# EAGLE board uSlices_v3.2 (EAGLE 8.3.2)
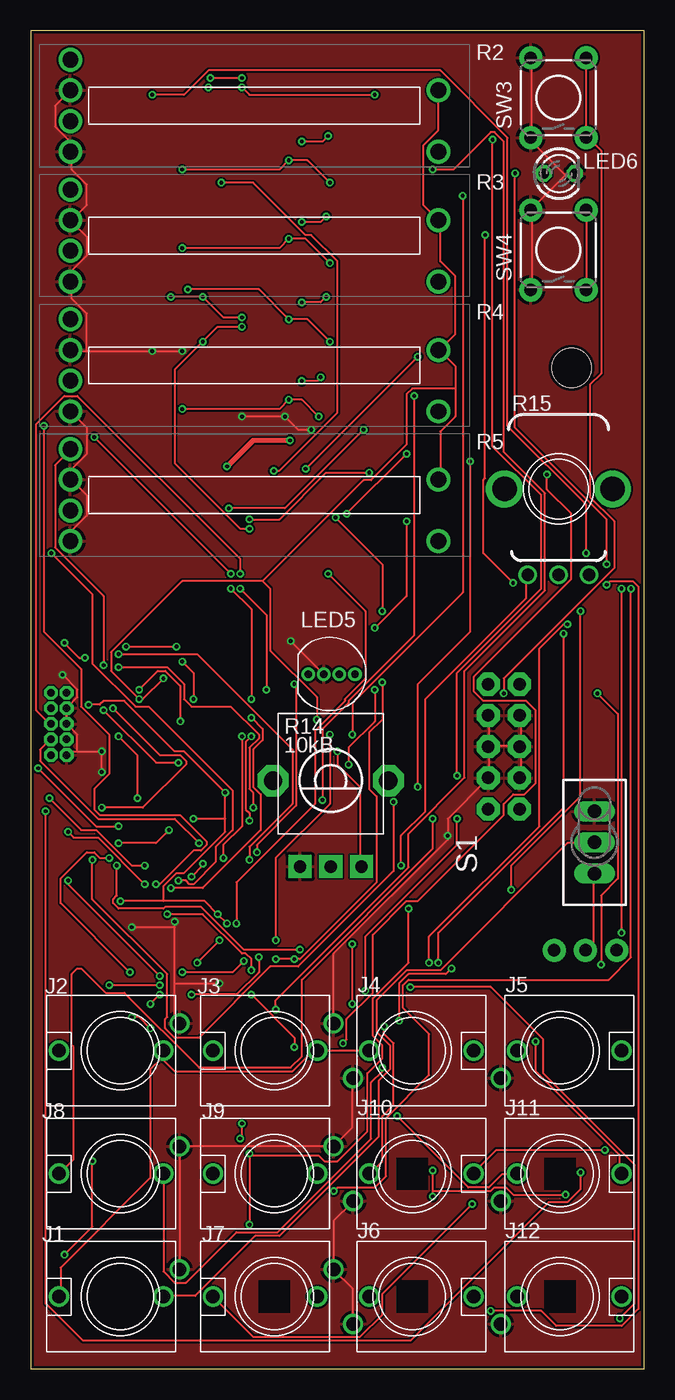
[diagram p3: board, top side]
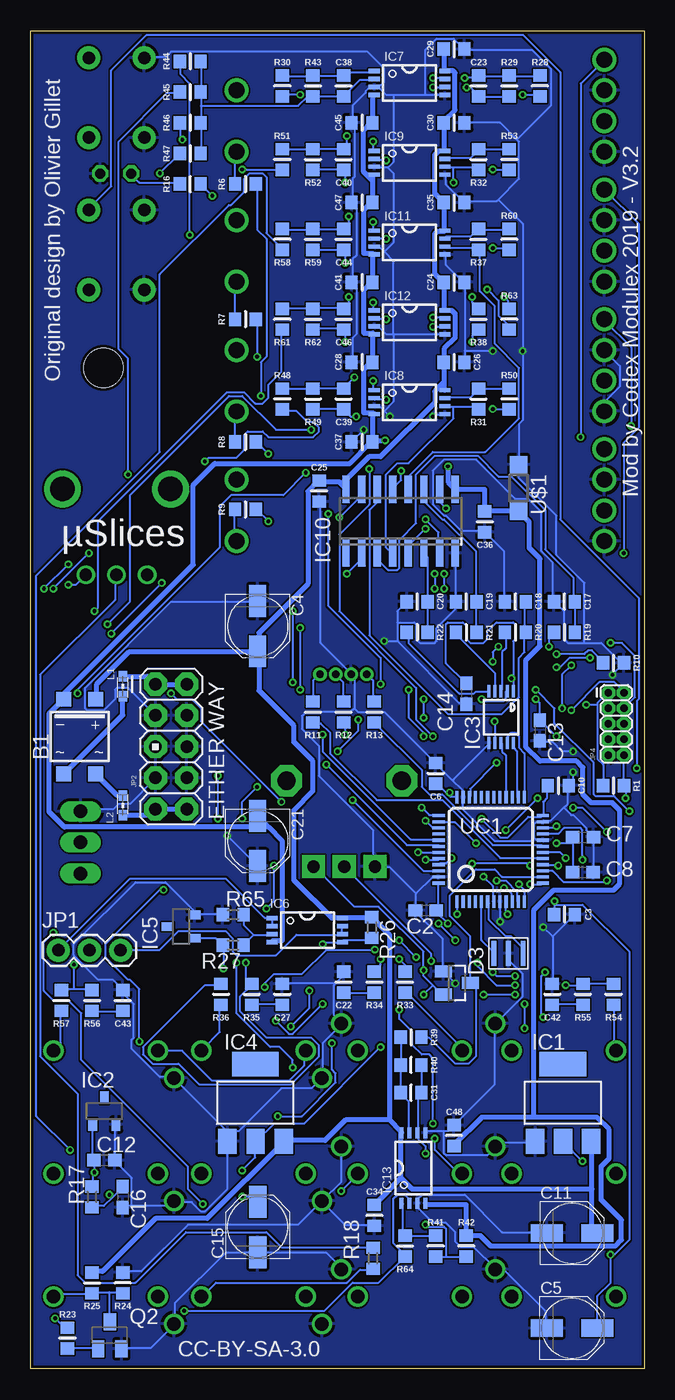
[diagram p4: board, bottom side, seen from below]

Size 50 x 109 mm. Coordinates in mm from the lower left corner, seen from the top.
Outline: 0,0 50,0 50,109 0,109 0,0
Copper layers (1*16): Top 0.035mm / dielectric 1.5mm / Bottom 0.035mm
Design rules "dirt_cheap_dirty_boards.v1.1": minimum track width 6mil, minimum drill 12mil, track to track 6mil, track to pad 6mil, pad to pad 6mil, via to via 6mil, smd to smd 0mil, copper to edge 10mil, drill to drill 10mil, minimum pad ring 10mil, minimum via ring 6mil, stop-mask expansion 2mil, vias tented up to drill 25mil, thermal gap 10mil
Holes 3.2 mm at 44.07,81.53

## Footprints (pad centres in the part's own frame; a part is rotated, then mirrored left to right if it is on the bottom)
SOIC-4 = smd 1.2 x 1.2: + 1.3,3.05; - -1.3,3.05; ~1 -1.3,-3.05; ~2 1.3,-3.05
C0603 = smd 1.1 x 1: 1 -0.85,0; 2 0.85,0
PARTS_AMAN_RESISTOR_0603 = smd 1 x 1.1: 1 -0.85,0; 2 0.85,0
PANASONIC_C = smd 2.6 x 1.4: + 2.05,0; - -2.05,0
SOT23 = smd 1 x 1.4: 1 -0.95,-1.1; 2 0.95,-1.1; 3 0,1.1
SOT223 = smd 1.499 x 2.007: 1 -2.261,-3.15; 2 0.025,-3.15; 3 2.311,-3.15 | smd 3.81 x 2.007: 4 0,3.15
DBZ_R-PDSO-G3 = smd 0.7 x 1: 1 -0.95,-1.1; 2 0.95,-1.1; 3 0,1.1
MSOP10 = smd 0.25 x 1: 1 -1,-2.113; 2 -0.5,-2.113; 3 0,-2.113; 4 0.5,-2.113; 5 1,-2.113; 6 1,2.113; 7 0.5,2.113; 8 0,2.113; 9 -0.5,2.113; 10 -1,2.113
TSSOP-8 = smd 0.9 x 0.35: 1 -2.875,0.975; 2 -2.875,0.325; 3 -2.875,-0.325; 4 -2.875,-0.975; 5 2.875,-0.975; 6 2.875,-0.325; 7 2.875,0.325; 8 2.875,0.975
SOIC16N = smd 0.6 x 2.2: 1 -4.445,-2.6; 2 -3.175,-2.6; 3 -1.905,-2.6; 4 -0.635,-2.6; 5 0.635,-2.6; 6 1.905,-2.6; 7 3.175,-2.6; 8 4.445,-2.6; 9 4.445,2.6; 10 3.175,2.6; 11 1.905,2.6; 12 0.635,2.6; 13 -0.635,2.6; 14 -1.905,2.6; 15 -3.175,2.6; 16 -4.445,2.6
INSTRUO_S_JACK_S2_INV = drill 1.1: GND 2.223,-4.826; NORM 0,-3.5; TIP 0,5
1X03 = drill 1.016 pad 1.88: 1 0,0; 2 2.54,0; 3 5.08,0
AVR_ICSP = drill 1.016 pad 1.88 octagon: 1 -1.27,5.08; 2 1.27,5.08; 3 -1.27,2.54; 4 1.27,2.54; 5 -1.27,0; 6 1.27,0; 7 -1.27,-2.54; 8 1.27,-2.54; 9 -1.27,-5.08; 10 1.27,-5.08
2X5-1.27 = drill 0.61 pad 1.067 octagon: 1 -1.27,3.81; 2 0,3.81; 3 -1.27,2.54; 4 0,2.54; 5 -1.27,1.27; 6 0,1.27; 7 -1.27,0; 8 0,0; 9 -1.27,-1.27; 10 0,-1.27
WUERTH-ELEKTRONIK_0603 = smd 0.85 x 0.7: 1 -0.9,0; 2 0.7,0
LED-TRICOLOR-THROUGHHOLE = drill 0.6: BLU 0.635,0; GND -0.635,0; GRN 1.905,0; RED -1.905,0
LED3MM = drill 0.813 octagon: A -1.27,0; K 1.27,0
INSTRUO_CRYSTAL_SMALLER = smd 0.4 x 2: GND 0,0; X1 -1.2,0; X2 1.2,0
SOT23-BEC = smd 1 x 1.4: B -0.95,-1.1; C 0,1.1; E 0.95,-1.1
PTL2010G0103B2 = drill 1.3 pad 1.95: 1 2.5,3.75; 2 2.5,1.25; 3 2.5,-1.25; 4 2.5,-3.75; 5 32.5,-3.75; 6 32.5,1.25
ALPS_POT_VERTICAL_PS = drill 1 pad 1.88 square: P$1 -2.5,7; P$2 0,7; P$3 2.5,7 | drill 1.5 pad 2.54 octagon: P$4 -4.7,0; P$5 4.7,0
INSTRUO_Q-POT2 = drill 1 pad 1.5: P$1 -2.5,-7; P$2 0,-7; P$3 2.5,-7 | drill 2 pad 2.5: P$4 -4.4,0; P$5 4.4,0
R0603 = smd 1 x 1.1: 1 -0.85,0; 2 0.85,0
TL3XPO = drill 1.1 pad 1.422 long: 1 -2.54,0; 2 0,0; 3 2.54,0
SPARKFUN_TACTILE-PTH = drill 1.016 pad 1.88: 1 -3.251,2.261; 2 3.251,2.261; 3 -3.251,-2.261; 4 3.251,-2.261
SOD123 = smd 1.4 x 1.4: A 1.9,0; C -1.9,0
LQFP48 = smd 0.254 x 1: 1 -2.75,-4.25; 2 -2.25,-4.25; 3 -1.75,-4.25; 4 -1.25,-4.25; 5 -0.75,-4.25; 6 -0.25,-4.25; 7 0.25,-4.25; 8 0.75,-4.25; 9 1.25,-4.25; 10 1.75,-4.25; 11 2.25,-4.25; 12 2.75,-4.25; 25 2.75,4.25; 26 2.25,4.25; 27 1.75,4.25; 28 1.25,4.25; 29 0.75,4.25; 30 0.25,4.25; 31 -0.25,4.25; 32 -0.75,4.25; 33 -1.25,4.25; 34 -1.75,4.25; 35 -2.25,4.25; 36 -2.75,4.25 | smd 1 x 0.254: 13 4.25,-2.75; 14 4.25,-2.25; 15 4.25,-1.75; 16 4.25,-1.25; 17 4.25,-0.75; 18 4.25,-0.25; 19 4.25,0.25; 20 4.25,0.75; 21 4.25,1.25; 22 4.25,1.75; 23 4.25,2.25; 24 4.25,2.75; 37 -4.25,2.75; 38 -4.25,2.25; 39 -4.25,1.75; 40 -4.25,1.25; 41 -4.25,0.75; 42 -4.25,0.25; 43 -4.25,-0.25; 44 -4.25,-0.75; 45 -4.25,-1.25; 46 -4.25,-1.75; 47 -4.25,-2.25; 48 -4.25,-2.75

## Placement (x,y rotation side)
B1  MB1S  [SOIC-4]  46,51.5 0 bottom
C2  100n  [C0603]  17.8,37.34 180 bottom
C3  100n  [PARTS_AMAN_RESISTOR_0603]  6.5,37 0 bottom
C4  22u  [PANASONIC_C]  31.5,60.5 270 bottom
C5  22u  [PANASONIC_C]  5.89,3.32 0 bottom
C6  100n  [PARTS_AMAN_RESISTOR_0603]  17,48.5 90 bottom
C7  100n  [C0603]  5,43.31 0 bottom
C8  3.3u  [C0603]  5.01,40.45 0 bottom
C10  100n  [PARTS_AMAN_RESISTOR_0603]  7,47.5 0 bottom
C11  22u  [PANASONIC_C]  5.88,11.06 0 bottom
C12  470n  [C0603]  44,17 0 bottom
C13  100n  [C0603]  8.5,52 270 bottom
C14  3.3u  [C0603]  14.5,55 270 bottom
C15  22u  [PANASONIC_C]  31.5,11.56 90 bottom
C16  100n  [C0603]  42.5,14 270 bottom
C17  1u  [PARTS_AMAN_RESISTOR_0603]  6.5,62.5 180 bottom
C18  1u  [PARTS_AMAN_RESISTOR_0603]  10.5,62.5 180 bottom
C19  1u  [PARTS_AMAN_RESISTOR_0603]  14.5,62.5 180 bottom
C20  1u  [PARTS_AMAN_RESISTOR_0603]  18.5,62.5 180 bottom
C21  22u  [PANASONIC_C]  31.5,43 270 bottom
C22  560p  [PARTS_AMAN_RESISTOR_0603]  24.5,31.5 90 bottom
C23  18p  [PARTS_AMAN_RESISTOR_0603]  13.5,104.5 90 bottom
C24  100n  [PARTS_AMAN_RESISTOR_0603]  15.5,88.5 0 bottom
C25  100n  [PARTS_AMAN_RESISTOR_0603]  26.5,71.5 270 bottom
C26  100n  [PARTS_AMAN_RESISTOR_0603]  15.5,82 0 bottom
C27  560p  [PARTS_AMAN_RESISTOR_0603]  29.5,30.5 90 bottom
C28  100n  [PARTS_AMAN_RESISTOR_0603]  23,82 0 bottom
C29  100n  [PARTS_AMAN_RESISTOR_0603]  15.5,107.5 0 bottom
C30  100n  [PARTS_AMAN_RESISTOR_0603]  15.5,101.5 0 bottom
C31  560p  [PARTS_AMAN_RESISTOR_0603]  19,22.5 180 bottom
C34  100n  [PARTS_AMAN_RESISTOR_0603]  22,12.5 270 bottom
C35  100n  [PARTS_AMAN_RESISTOR_0603]  15.5,95 0 bottom
C36  100n  [PARTS_AMAN_RESISTOR_0603]  13,69 90 bottom
C37  100n  [PARTS_AMAN_RESISTOR_0603]  23,75.5 0 bottom
C38  18p  [PARTS_AMAN_RESISTOR_0603]  24.5,104.5 90 bottom
C39  18p  [PARTS_AMAN_RESISTOR_0603]  24.5,79 90 bottom
C40  18p  [PARTS_AMAN_RESISTOR_0603]  24.5,98.5 90 bottom
C41  100n  [PARTS_AMAN_RESISTOR_0603]  23,88.5 0 bottom
C42  560p  [PARTS_AMAN_RESISTOR_0603]  7.5,30.5 90 bottom
C43  560p  [PARTS_AMAN_RESISTOR_0603]  42.5,30 90 bottom
C44  18p  [PARTS_AMAN_RESISTOR_0603]  24.5,92 90 bottom
C45  100n  [PARTS_AMAN_RESISTOR_0603]  23,101.5 0 bottom
C46  18p  [PARTS_AMAN_RESISTOR_0603]  24.5,85.5 90 bottom
C47  100n  [PARTS_AMAN_RESISTOR_0603]  23,95 0 bottom
C48  100n  [PARTS_AMAN_RESISTOR_0603]  15.5,19 270 bottom
D3  BAT54S  [SOT23]  15.26,31.43 270 bottom
IC1  LM1117-3.3  [SOT223]  6.63,21.68 0 bottom
IC2  LM4040B25  [DBZ_R-PDSO-G3]  44,21 0 bottom
IC3  DAC124S085CIMT  [MSOP10]  11.67,53.09 180 bottom
IC4  LM1117-3.3  [SOT223]  31.7,21.68 0 bottom
IC5  LM4040B10  [DBZ_R-PDSO-G3]  37.74,36.02 90 bottom
IC6  TL072TSSOP  [TSSOP-8]  27.45,35.74 0 bottom
IC7  TL072TSSOP  [TSSOP-8]  19.13,104.74 0 bottom
IC8  TL072TSSOP  [TSSOP-8]  19.13,78.74 0 bottom
IC9  TL072TSSOP  [TSSOP-8]  19.13,98.24 0 bottom
IC10  V2164SZ  [SOIC16N]  19.86,69.04 0 bottom
IC11  TL072TSSOP  [TSSOP-8]  19.13,91.74 0 bottom
IC12  TL072TSSOP  [TSSOP-8]  19.13,85.24 0 bottom
IC13  TL072TSSOP  [TSSOP-8]  18.81,16.36 90 bottom
J1  [INSTRUO_S_JACK_S2_INV]  7.31,5.88 90 top
J2  [INSTRUO_S_JACK_S2_INV]  7.31,25.91 90 top
J3  [INSTRUO_S_JACK_S2_INV]  19.86,25.91 90 top
J4  [INSTRUO_S_JACK_S2_INV]  31.09,25.91 270 top
J5  [INSTRUO_S_JACK_S2_INV]  43.14,25.91 270 top
J6  [INSTRUO_S_JACK_S2_INV]  31.09,5.88 270 top
J7  [INSTRUO_S_JACK_S2_INV]  19.86,5.88 90 top
J8  [INSTRUO_S_JACK_S2_INV]  7.31,15.89 90 top
J9  [INSTRUO_S_JACK_S2_INV]  19.86,15.89 90 top
J10  [INSTRUO_S_JACK_S2_INV]  31.09,15.89 270 top
J11  [INSTRUO_S_JACK_S2_INV]  43.14,15.89 270 top
J12  [INSTRUO_S_JACK_S2_INV]  43.14,5.88 270 top
JP1  [1X03]  47.75,34.09 0 bottom
JP2  M05X2PTH  [AVR_ICSP]  38.56,50.68 0 bottom
JP4  M05X2MINIJTAG  [2X5-1.27]  1.66,51.27 0 bottom
L1  [WUERTH-ELEKTRONIK_0603]  42.5,55.5 270 bottom
L2  [WUERTH-ELEKTRONIK_0603]  42.5,46 90 bottom
LED5  WP154A4SUREQBFZG  [LED-TRICOLOR-THROUGHHOLE]  24.52,56.58 0 top
LED6  [LED3MM]  43.07,97.37 0 top
Q1  8MHz  [INSTRUO_CRYSTAL_SMALLER]  11.07,33.84 0 bottom
Q2  MMBT3904  [SOT23-BEC]  43.55,2.74 0 bottom
R1  10k  [PARTS_AMAN_RESISTOR_0603]  2.5,47.5 180 bottom
R2  PTL20-10G0-103B2  [PTL2010G0103B2]  0.74,102.89 0 top
R3  PTL20-10G0-103B2  [PTL2010G0103B2]  0.74,92.32 0 top
R4  PTL20-10G0-103B2  [PTL2010G0103B2]  0.74,81.74 0 top
R5  PTL20-10G0-103B2  [PTL2010G0103B2]  0.74,71.17 0 top
R6  100  [PARTS_AMAN_RESISTOR_0603]  32.5,96.5 0 bottom
R7  100  [PARTS_AMAN_RESISTOR_0603]  32.5,85.5 0 bottom
R8  100  [PARTS_AMAN_RESISTOR_0603]  32.5,75.5 0 bottom
R9  100  [PARTS_AMAN_RESISTOR_0603]  32.5,70 0 bottom
R10  10k  [PARTS_AMAN_RESISTOR_0603]  2.5,57.5 180 bottom
R11  100  [PARTS_AMAN_RESISTOR_0603]  27,53.5 90 bottom
R12  100  [PARTS_AMAN_RESISTOR_0603]  24.5,53.5 90 bottom
R13  100  [PARTS_AMAN_RESISTOR_0603]  22,53.5 90 bottom
R14  10kB  [ALPS_POT_VERTICAL_PS]  24.45,47.91 180 top
R15  10kB CD  [INSTRUO_Q-POT2]  43.01,71.67 0 top
R16  100  [PARTS_AMAN_RESISTOR_0603]  37,96.5 180 bottom
R17  510  [R0603]  45,14 90 bottom
R18  100k  [R0603]  22.1,9 90 bottom
R19  100  [PARTS_AMAN_RESISTOR_0603]  6.5,60 0 bottom
R20  100  [PARTS_AMAN_RESISTOR_0603]  10.5,60 0 bottom
R21  100  [PARTS_AMAN_RESISTOR_0603]  14.5,60 0 bottom
R22  100  [PARTS_AMAN_RESISTOR_0603]  18.5,60 0 bottom
R23  10k  [PARTS_AMAN_RESISTOR_0603]  47,2.5 270 bottom
R24  3.3k  [PARTS_AMAN_RESISTOR_0603]  42.5,7 270 bottom
R25  4.7k  [PARTS_AMAN_RESISTOR_0603]  45,7 90 bottom
R26  4.7k  [R0603]  22.19,35.95 270 bottom
R27  100k  [R0603]  33.5,34.5 180 bottom
R28  1k  [PARTS_AMAN_RESISTOR_0603]  8.5,104.5 270 bottom
R29  100k  [PARTS_AMAN_RESISTOR_0603]  11,104.5 90 bottom
R30  100k  [PARTS_AMAN_RESISTOR_0603]  29.5,104.5 270 bottom
R31  100k  [PARTS_AMAN_RESISTOR_0603]  13.5,79 90 bottom
R32  100k  [PARTS_AMAN_RESISTOR_0603]  13.5,98.5 90 bottom
R33  100k  [PARTS_AMAN_RESISTOR_0603]  19.5,31.5 90 bottom
R34  510  [PARTS_AMAN_RESISTOR_0603]  22,31.5 90 bottom
R35  510  [PARTS_AMAN_RESISTOR_0603]  32,30.5 90 bottom
R36  100k  [PARTS_AMAN_RESISTOR_0603]  34.5,30.5 90 bottom
R37  100k  [PARTS_AMAN_RESISTOR_0603]  13.5,92 90 bottom
R38  100k  [PARTS_AMAN_RESISTOR_0603]  13.5,85.5 90 bottom
R39  1k  [PARTS_AMAN_RESISTOR_0603]  19,27 0 bottom
R40  33k  [PARTS_AMAN_RESISTOR_0603]  19,24.75 180 bottom
R41  100k  [PARTS_AMAN_RESISTOR_0603]  17,10 270 bottom
R42  240k  [PARTS_AMAN_RESISTOR_0603]  14.5,10 270 bottom
R43  49.9k  [PARTS_AMAN_RESISTOR_0603]  27,104.5 90 bottom
R44  100k  [PARTS_AMAN_RESISTOR_0603]  37,106.5 0 bottom
R45  100k  [PARTS_AMAN_RESISTOR_0603]  37,104 0 bottom
R46  100k  [PARTS_AMAN_RESISTOR_0603]  37,101.5 0 bottom
R47  100k  [PARTS_AMAN_RESISTOR_0603]  37,99 0 bottom
R48  1k  [PARTS_AMAN_RESISTOR_0603]  29.5,79 270 bottom
R49  100k  [PARTS_AMAN_RESISTOR_0603]  27,79 90 bottom
R50  100k  [PARTS_AMAN_RESISTOR_0603]  11,79 270 bottom
R51  1k  [PARTS_AMAN_RESISTOR_0603]  29.5,98.5 270 bottom
R52  100k  [PARTS_AMAN_RESISTOR_0603]  27,98.5 90 bottom
R53  100k  [PARTS_AMAN_RESISTOR_0603]  11,98.5 270 bottom
R54  100k  [PARTS_AMAN_RESISTOR_0603]  2.5,30.5 90 bottom
R55  510  [PARTS_AMAN_RESISTOR_0603]  5,30.5 90 bottom
R56  510  [PARTS_AMAN_RESISTOR_0603]  45,30 90 bottom
R57  100k  [PARTS_AMAN_RESISTOR_0603]  47.5,30 90 bottom
R58  1k  [PARTS_AMAN_RESISTOR_0603]  29.5,92 270 bottom
R59  100k  [PARTS_AMAN_RESISTOR_0603]  27,92 90 bottom
R60  100k  [PARTS_AMAN_RESISTOR_0603]  11,92 270 bottom
R61  1k  [PARTS_AMAN_RESISTOR_0603]  29.5,85.5 270 bottom
R62  100k  [PARTS_AMAN_RESISTOR_0603]  27,85.5 90 bottom
R63  100k  [PARTS_AMAN_RESISTOR_0603]  11,85.5 270 bottom
R64  100k  [PARTS_AMAN_RESISTOR_0603]  19.5,10 90 bottom
R65  100k  [R0603]  33.5,37 0 bottom
S1  TL32PO  [TL3XPO]  45.94,42.88 270 top
SW3  [SPARKFUN_TACTILE-PTH]  43.01,103.54 90 top
SW4  [SPARKFUN_TACTILE-PTH]  43.01,91.14 90 top
U$1  1N5819HW  [SOD123]  10.25,71.75 270 bottom
UC1  STM32F103CBT6  [LQFP48]  12.51,42.31 0 bottom

## Tracks (layer width: path | path; a pad name or v marks a point on that pad's centre or on a via)
+3V3  (via drill 0.3)
  Top 0.152: v5.03,16.92 5.03,11.58 v2.74,9.3 | v16,36.27 v15.24,37.03 14.17,38.1 10.82,38.1 | 10.82,38.1 v7.32,38.1 | 15.85,44.81 15.85,43.74 12.5,40.39 11.89,40.39 10.82,39.32 10.82,38.1 | 15.85,44.81 v15.85,46.94 12.5,50.29 11.73,50.29 7.62,54.41 5.94,54.41 5.64,54.1 v4.72,54.1 | 15.85,44.81 v13.26,44.81
  Bottom 0.152: v5.03,16.92 6.55,18.44 IC1.2 | C5.+ 3.81,3.35 3.81,5.94 2.74,7.01 v2.74,9.3 2.44,9.3 1.22,10.52 1.22,33.98 5.03,37.8 7.32,37.8 | 3.81,54.1 3.81,54.25 3.05,55.02 JP4.1 | 3.81,54.1 3.81,49.68 3.35,49.23 3.35,47.55 R1.2 | C10.1 7.92,47.4 7.92,46.48 8.23,46.18 8.23,45.11 UC1.24 8.38,44.96 9.45,44.96 11.12,43.28 11.73,43.28 v13.26,44.81 | 16,46.79 16.92,47.7 C6.1 | 16,46.79 15.85,46.63 15.24,46.63 UC1.36 | v15.24,37.03 15.24,37.95 UC1.1 | v16,36.27 16.92,37.19 C2.1 16.92,37.34 16.76,37.49 16.76,39.47 UC1.48 | v7.32,38.1 7.32,37.8 | 7.32,37.8 7.32,37.03 C3.1 | v15.85,46.94 16,46.79 | v4.72,54.1 3.81,54.1
+3V3_A  (via drill 0.3)
  Top 0.152: v32.77,14.02 32.77,14.48 | 32.77,14.48 v32.77,16.15 | v43.59,14.17 39.32,14.17 38.71,14.78 37.8,14.78 37.49,14.48 32.77,14.48 | v11.12,37.03 14.02,37.03 17.22,33.83 17.53,33.83 17.98,33.38 v17.98,32.46 | v21.49,26.21 21.49,26.98 v17.98,30.48 | v10.82,56.24 9.14,54.56 v8.84,54.56 6.55,56.84 6.55,58.37 12.34,64.16 18.9,64.16 | v7.16,42.82 10.21,42.82 v11.28,43.89 | v8.69,46.48 8.69,49.99 v7.16,51.51 | 34.59,79.86 34.59,81.69 33.38,82.91 R4.6 33.38,83.06 34.59,84.28 34.59,89 33.38,90.22 33.38,93.42 R3.6 33.22,93.57 32,94.79 32,99.67 33.22,100.89 33.22,104.09 R2.6 | 34.59,79.86 34.59,77.57 33.38,76.35 33.38,72.54 R5.6 | 18.9,64.16 27.13,72.39 27.74,72.39 30.63,75.29 30.63,79.4 31.09,79.86 34.59,79.86 | v24.99,50.29 24.99,49.23 26.82,47.4 26.82,41 R14.P$1 | v23.32,52.88 23.32,54.71 19.51,58.52 19.51,63.55 18.9,64.16
  Bottom 0.152: 43.28,14.02 42.52,14.78 C16.1 | 43.28,14.02 44.04,13.26 44.96,13.26 R17.1 | v32.77,16.15 31.7,17.22 31.7,18.44 IC4.2 31.55,18.59 30.18,19.96 27.74,19.96 v21.49,26.21 | v32.77,14.02 31.85,14.02 31.55,13.72 C15.+ | 43.28,14.02 43.43,14.02 v43.59,14.17 | v11.12,37.03 11.28,37.19 11.28,37.95 UC1.9 | 17.22,31.24 16.46,30.48 D3.2 | 17.22,31.24 17.98,32 v17.98,32.46 17.98,33.98 21.64,37.64 23.62,37.64 26.82,40.84 R14.P$1 | 17.22,31.24 v17.98,30.48 | 5.79,42.82 5.79,40.54 C8.1 | 5.79,42.82 5.79,43.28 C7.1 5.79,42.82 | 10.67,56.24 10.67,59.28 10.52,59.44 10.52,60.66 10.67,60.81 12.04,60.81 12.8,60.05 12.8,59.44 13.11,59.13 14.17,59.13 14.48,59.44 14.48,60.5 14.78,60.81 16,60.81 16.15,60.66 16.15,57.45 14.63,55.93 C14.1 | 10.67,56.24 10.67,55.32 IC3.1 | v8.84,54.56 8.53,54.25 8.53,52.88 C13.1 8.38,52.73 v7.16,51.51 | 10.67,56.24 v10.82,56.24 | v7.16,42.82 5.79,42.82 | v8.69,46.48 v11.28,43.89 | v24.99,50.29 23.32,51.97 v23.32,52.88
ADD_SWITCH  (via drill 0.3)
  Top 0.152: v5.03,41.45 5.03,38.25 11.12,32.16 11.12,28.65 10.97,28.5 10.97,27.74 11.73,26.98 13.72,26.98 19.51,32.77 21.79,32.77 29.57,40.54 v29.57,46.18 | v38.56,55.02 38.56,56.24 47.55,65.23 47.55,69.04 45.57,71.02 45.57,80.16 46.48,81.08 46.48,99.21 45.41,100.28 SW3.3 45.26,100.43 45.26,106.68 SW3.4
  Bottom 0.152: v5.03,41.45 5.03,43.89 5.18,44.04 6.55,44.04 7.01,43.59 8.23,43.59 UC1.21 | v29.57,46.18 36.12,52.73 36.12,53.8 36.88,54.56 38.1,54.56 v38.56,55.02
AREF_2.5  (via drill 0.3)
  Top 0.152: v12.19,52.73 12.19,55.63 10.97,56.84 10.36,56.84 v8.84,55.32 | v1.22,45.41 1.22,5.33 4.27,2.29 30.94,2.29 42.22,13.56 43.74,13.56 44.81,14.63 v44.81,16
  Bottom 0.152: v12.19,52.73 12.19,51.05 IC3.7 | v8.84,55.32 7.32,53.8 7.32,52.58 4.12,49.38 4.12,46.79 3.96,46.63 2.44,46.63 v1.22,45.41 | IC2.1 44.96,19.81 44.96,17.07 C12.1 44.81,16.92 v44.81,16 44.96,15.85 44.96,14.94 R17.2
AREF_5
  Bottom 0.152: IC6.2 30.33,36.12 30.33,36.58 IC6.1 30.94,36.73 34.14,39.93 41.91,39.93 47.7,34.14 JP1.1
AREF_10
  Bottom 0.152: IC6.7 24.69,35.97 24.69,35.51 IC6.6 24.69,35.36 28.35,35.36 30.02,33.68 33.22,33.68 33.53,33.98 33.53,35.05 34.14,35.66 37.95,35.66 39.47,34.14 42.52,34.14 JP1.3
AREF_10_0  (via drill 0.3)
  Top 0.152: v26.21,29.72 v26.21,34.59 | v30.02,28.35 30.02,31.39 30.79,32.16 33.83,32.16 v34.29,32.61
  Bottom 0.152: R26.2 22.25,35.05 22.4,34.9 24.54,34.9 IC6.5 24.69,34.75 26.06,34.75 v26.21,34.59 | IC5.1 36.58,35.05 34.9,35.05 34.44,34.59 R27.2 34.29,34.44 v34.29,32.61 | v26.21,29.72 28.65,27.28 28.96,27.28 v30.02,28.35
BOOT_FLASH  (via drill 0.3)
  Top 0.152: v17.83,41.45 17.83,42.52 21.34,46.02 21.34,50.44 13.56,58.22 v7.16,58.22
  Bottom 0.152: v17.83,41.45 16.76,41.45 UC1.44 | v7.16,58.22 4.88,58.22 4.57,58.52 4.27,58.52 3.35,57.61 R10.2
DAC_MOSI
  Bottom 0.152: UC1.28 11.28,46.63 11.28,49.99 11.58,50.29 11.58,50.9 IC3.8
DAC_SCK
  Bottom 0.152: UC1.26 10.36,46.63 10.36,50.29 10.67,50.6 10.67,50.9 IC3.10
DAC_SS
  Bottom 0.152: UC1.25 9.75,46.63 9.75,50.14 10.21,50.6 10.21,51.51 10.52,51.82 10.82,51.82 11.12,51.51 11.12,51.05 IC3.9
DEL_SWITCH  (via drill 0.3)
  Top 0.152: v7.16,44.2 5.33,44.2 v0.61,48.92 | SW4.3 45.26,87.94 45.26,94.34 SW4.4
  Bottom 0.152: v7.16,44.2 7.32,44.04 8.23,44.04 UC1.22 | v0.61,48.92 0.61,54.41 0.46,54.56 0.46,62.79 6.86,69.19 6.86,105.61 9.91,108.66 40.54,108.66 43.43,105.77 43.43,96.32 45.26,94.49 SW4.4
FB_CURRENT  (via drill 0.3)
  Top 0.152: v10.52,31.24 v6.4,31.24 | v15.39,34.9 v13.56,33.07 | v16.76,36.27 16.76,39.62 23.16,46.02 23.16,51.97 25.6,54.41 25.6,54.56 27.28,56.24 27.28,61.72 v24.23,64.77
  Bottom 0.152: R54.2 2.59,31.39 4.88,31.39 R55.2 5.03,31.24 v6.4,31.24 | v10.52,31.24 12.04,31.24 13.56,32.77 v13.56,33.07 | v16.76,36.27 v15.39,34.9 | v24.23,64.77 23.16,65.84 23.16,66.29 IC10.2
FB_CURRENT1  (via drill 0.3)
  Top 0.152: v19.96,33.38 v21.49,33.38 21.95,33.38 28.19,39.62 28.19,46.63 27.58,47.24 27.58,51.82 28.65,52.88 v28.65,55.93 | v28.65,61.72 28.65,65.53 v24.84,69.34
  Bottom 0.152: v19.96,33.38 19.51,32.92 19.51,32.46 R33.2 | v21.49,33.38 21.49,32.92 21.95,32.46 R34.2 | v28.65,61.72 v28.65,55.93 | v24.84,69.34 23.16,71.02 23.16,71.63 IC10.15
FB_CURRENT2  (via drill 0.3)
  Top 0.152: v16.15,70.1 20.73,70.1 v27.13,76.5 | v43.74,60.66 43.43,60.66 41.45,58.67 41.45,44.2 32.46,35.2 v32.46,33.07
  Bottom 0.152: R36.2 34.59,31.24 35.81,31.24 40.84,26.21 40.84,25.6 40.08,24.84 37.95,24.84 36.27,23.16 28.8,23.16 26.52,25.45 26.52,26.36 27.13,26.98 30.79,26.98 32.92,29.11 32.92,30.33 32,31.24 R35.2 32,31.39 32.46,31.85 v32.46,33.07 | v16.15,70.1 16.61,70.56 16.61,71.63 IC10.10 | v27.13,76.5 30.02,76.5 32.77,79.25 33.83,79.25 41.91,71.17 41.91,62.48 v43.74,60.66
FB_CURRENT3  (via drill 0.3)
  Top 0.152: v46.48,32.92 46.48,38.56 47.85,39.93 47.85,53.34 v46.18,55.02 | v27.58,73 24.08,73 20.27,69.19 v17.83,69.19
  Bottom 0.152: 46.48,30.94 47.4,30.94 R57.2 | 46.48,30.94 45.11,30.94 R56.2 | v46.48,32.92 46.48,30.94 | v46.18,55.02 46.18,55.32 34.59,66.9 34.59,70.26 33.68,71.17 29.41,71.17 v27.58,73 | v17.83,69.19 16.76,68.12 16.76,66.45 IC10.7
FRAME_CHANGE  (via drill 0.3)
  Top 0.152: v7.01,41 7.01,38.56 6.71,38.25 6.71,37.95 7.16,37.49 10.82,37.49 10.97,37.64 13.87,37.64 17.37,34.14 v21.95,34.14 | v30.94,31.09 37.49,31.09 41.76,26.82 41.76,24.08 49.23,16.61 49.23,5.33 v48.01,4.12
  Bottom 0.152: v7.01,41 8.23,41 UC1.16 | v21.95,34.14 25.91,34.14 27.89,32.16 30.18,32.16 30.94,31.39 v30.94,31.09 | v48.01,4.12 47.09,3.2 R23.1
GAIN_1
  Bottom 0.152: R19.2 5.64,60.05 5.64,62.48 C17.1 5.79,62.64 5.79,64.47 8.08,66.75 8.08,69.95 10.82,72.69 11.89,72.69 13.56,74.37 17.07,74.37 18.59,72.85 18.59,68.89 19.96,67.51 19.96,65.23 20.12,65.08 20.88,65.08 21.64,65.84 21.64,66.29 IC10.3
GAIN_2
  Bottom 0.152: C18.1 9.75,62.48 9.75,60.05 R20.2 9.75,59.89 9.75,58.37 10.21,57.91 10.21,54.71 11.58,53.34 16,53.34 22.4,59.74 22.4,69.95 21.79,70.56 21.79,71.63 IC10.14
GAIN_3
  Bottom 0.152: R21.2 13.72,60.05 13.72,62.48 C19.1 13.72,62.64 13.72,66.6 16.31,69.19 16.46,69.19 17.83,70.56 17.83,71.63 IC10.11
GAIN_4
  Bottom 0.152: R22.2 17.68,60.05 17.68,62.48 C20.1 17.68,62.64 17.68,66.14 17.83,66.29 IC10.6
GND  (via drill 0.3)
  Top 0.152: R2.2 3.2,104.09 1.98,102.87 1.98,101.19 3.2,99.97 3.2,99.21 R2.4 3.35,99.06 3.35,97.69 4.57,96.47 4.57,94.79 3.35,93.57 R3.2 3.35,93.42 4.57,92.2 4.57,90.68 3.35,89.46 3.35,88.7 R3.4 3.35,88.54 3.35,87.17 4.57,85.95 4.57,82.91 | R5.4 3.35,67.51 3.35,68.28 4.57,69.49 4.57,71.17 3.35,72.39 R5.2 3.35,72.54 3.35,73.3 4.57,74.52 4.57,76.66 3.35,77.88 R4.4 | 4.57,82.91 3.35,82.91 R4.2 | 4.57,82.91 v9.91,82.91 v12.34,82.91 | 43.59,97.23 44.2,97.23 LED6.K | 43.59,97.23 40.84,94.49 SW4.2 40.84,94.34 40.84,87.94 SW4.1 | 43.59,97.23 40.84,99.97 40.84,100.28 SW3.1 40.84,100.43 40.84,106.68 SW3.2 | v17.22,77.57 v20.73,77.57 21.79,76.5 v22.86,76.5 | 3.81,50.29 3.2,50.29 3.05,50.14 JP4.9 | 3.81,50.29 v5.79,50.29 v5.79,48.62 | 3.81,50.29 3.81,51.66 3.05,52.43 JP4.5 2.9,52.58 2.9,53.8 JP4.3 3.05,53.95 3.81,54.71 3.81,55.32 v2.59,56.54 | v21.18,59.28 23.77,56.69 LED5.GND | 11.73,31.39 11.73,28.5 12.04,28.19 J2.GND | 11.73,31.39 11.73,35.97 | 11.73,35.97 v11.73,36.42 | 11.73,35.97 v8.23,35.97 | J1.GND 12.19,8.23 12.19,17.98 J8.GND 12.19,18.14 24.54,18.14 J9.GND 24.69,18.14 26.21,19.66 26.21,23.62 J4.GND | 37.34,50.75 37.34,53.19 JP2.4 | JP2.5 39.93,50.75 39.93,53.19 JP2.3 | 37.34,50.75 39.78,50.75 JP2.5 | 37.34,50.75 JP2.6 37.34,50.6 37.34,48.16 JP2.8 37.19,48.01 33.98,44.81 v33.98,43.43 33.98,43.13 24.69,33.83 24.69,28.19 J3.GND | JP2.7 39.93,48.16 39.93,50.6 JP2.5 | J6.GND 26.21,3.66 26.21,6.55 24.69,8.08 J7.GND 24.69,8.23 24.69,12.04 26.21,13.56 J10.GND | 11.73,31.39 v15.39,31.39
  Bottom 0.152: IC11.5 16.15,90.68 16.15,89.92 14.78,88.54 C24.2 14.63,88.39 14.63,82.91 | 14.63,82.91 14.63,82.14 C26.2 | R4.4 3.2,78.03 3.2,78.79 1.98,80.01 1.98,81.69 3.2,82.91 R4.2 | v12.34,82.91 14.63,82.91 | C18.2 11.43,62.64 11.43,66.6 12.95,68.12 C36.1 13.11,68.28 14.94,68.28 16.15,69.49 16.31,69.49 17.22,70.41 17.22,73.15 16.31,74.07 13.72,74.07 10.52,70.87 9.45,70.87 8.38,69.8 8.38,66.6 7.47,65.68 7.47,62.64 C17.2 7.32,62.48 6.55,61.72 6.55,59.44 6.25,59.13 4.88,59.13 | 4.88,59.13 3.5,59.13 1.98,57.61 1.68,57.61 R10.1 1.68,57.45 v2.59,56.54 | 4.88,59.13 4.88,64.01 7.16,66.29 7.16,69.49 10.21,72.54 10.21,73.61 U$1.C 10.21,73.76 10.21,76.96 9.91,77.27 v9.91,82.91 9.91,93.27 11.89,95.25 | v17.22,77.57 17.07,77.72 16.31,77.72 IC8.5 | 21.18,78.03 21.49,78.33 21.95,78.33 IC8.3 | 21.18,78.03 v20.73,77.57 | v22.86,76.5 23.77,75.59 C37.1 | 20.42,84.28 21.03,84.28 21.64,84.89 21.95,84.89 IC12.3 | 20.42,84.28 16.31,84.28 IC12.5 | 21.18,90.98 20.42,90.22 20.42,84.28 | 21.18,90.98 21.64,91.44 21.95,91.44 IC11.3 | 21.18,78.03 20.42,78.79 20.42,84.28 | C28.1 23.77,82.14 23.77,83.97 23.47,84.28 23.47,88.09 23.77,88.39 C41.1 23.77,88.54 23.77,90.37 23.47,90.68 23.47,94.64 23.77,94.94 C47.1 23.77,95.1 23.77,96.93 23.62,97.08 23.62,101.35 23.77,101.5 C45.1 23.77,101.65 23.77,102.87 22.71,103.94 22.71,104.09 22.4,104.39 22.1,104.39 IC7.3 | IC9.5 16.15,97.23 16.15,96.47 14.78,95.1 C35.2 14.63,95.1 12.04,95.1 11.89,95.25 | 10.36,100.13 10.21,99.97 10.21,96.93 11.89,95.25 | 10.36,100.13 11.73,101.5 14.63,101.5 C30.2 | 20.42,103.78 21.03,103.78 21.64,104.39 | 20.42,103.78 17.83,103.78
  Bottom 0.152: 17.83,103.78 16.31,103.78 IC7.5 | 21.64,104.39 21.95,104.39 IC7.3 | 20.88,97.84 21.95,97.84 IC9.3 | 20.88,97.84 20.42,98.3 20.42,103.78 | 17.83,103.78 17.83,107.44 16.92,108.36 15.54,108.36 14.78,107.59 C29.2 14.63,107.44 9.14,107.44 7.62,105.92 7.62,102.87 10.36,100.13 | 21.18,90.98 20.42,91.75 20.42,97.38 20.88,97.84 | 21.64,104.39 21.18,104.85 21.18,105.92 22.55,107.29 38.56,107.29 39.01,106.83 40.69,106.83 SW3.2 | 21.64,104.39 IC7.3 | v5.79,50.29 6.71,50.29 7.47,51.05 8.38,51.05 C13.2 | 15.7,48.01 16.92,49.23 C6.2 17.07,49.38 21.18,53.49 23.32,53.49 23.62,53.8 | 15.7,48.01 14.78,47.09 14.78,46.63 UC1.35 14.78,46.48 14.78,45.57 12.19,42.98 9.3,42.98 8.99,43.28 | 15.7,48.01 15.54,48.01 12.65,50.9 IC3.6 | C8.2 4.12,40.54 4.12,43.28 C7.2 4.27,43.43 4.72,43.89 4.72,44.04 5.79,45.11 5.94,45.11 6.55,45.72 | 8.99,43.28 8.84,43.13 8.38,43.13 UC1.20 | 8.99,43.28 8.99,44.35 8.84,44.5 8.38,44.5 UC1.23 8.23,44.65 7.62,44.65 6.55,45.72 | 6.55,45.72 6.25,46.02 6.25,47.4 C10.2 6.1,47.55 5.79,47.85 v5.79,48.62 | 18.59,38.71 17.22,40.08 16.76,40.08 UC1.47 | 18.59,38.71 18.59,37.34 C2.2 18.59,37.19 16.46,35.05 16.46,32.46 D3.1 16.31,32.31 v15.39,31.39 | 18.59,38.71 20.73,40.84 21.95,40.84 R14.P$3 22.1,41 22.1,43.89 26.52,48.31 26.52,50.75 27.89,52.12 27.89,53.19 27.58,53.49 23.93,53.49 23.62,53.8 | IC10.8 15.39,66.29 15.39,62.64 C19.2 15.39,62.48 15.39,61.87 16.92,60.35 16.92,59.28 17.07,59.13 18.29,59.13 18.59,59.44 18.59,60.66 18.75,60.81 20.12,60.81 | 20.12,59.28 15.09,54.25 14.63,54.25 C14.2 | 20.12,60.81 20.12,61.72 19.36,62.48 C20.2 | 20.12,60.81 20.12,59.28
  Bottom 0.152: C25.2 26.36,70.56 26.36,59.13 23.93,56.69 LED5.GND 23.77,56.54 23.62,56.39 23.62,53.8 | v21.18,59.28 20.12,59.28 | 7.47,35.2 7.47,31.39 C42.2 | 7.47,35.2 5.79,36.88 C3.2 | v11.73,36.42 11.73,37.95 UC1.8 | Q1.GND 10.97,33.83 10.97,33.22 9.91,32.16 9.91,30.33 12.04,28.19 J2.GND 12.19,28.04 12.19,23.16 15.39,19.96 C48.1 15.54,19.81 16,19.36 16.31,19.36 | v8.23,35.97 7.47,35.2 | 16.31,19.36 17.83,19.36 IC13.5 | 16.31,19.36 16.31,17.53 16.15,17.37 12.8,17.37 12.19,17.98 J8.GND 12.04,18.14 11.73,18.44 8.99,18.44 IC1.1 | C5.- 8.08,3.35 8.08,4.72 11.43,8.08 12.04,8.08 J1.GND 12.19,8.23 13.87,9.91 14.94,9.91 15.39,10.36 15.39,11.12 16.15,11.89 17.22,11.89 18.44,13.11 18.44,13.41 IC13.3 18.44,13.56 18.44,13.87 18.14,14.17 14.63,14.17 11.58,11.12 8.08,11.12 C11.- | v33.98,43.43 31.55,41 C21.+ | S1.1 45.87,45.57 43.28,45.57 42.82,46.02 41.91,46.02 39.93,48.01 JP2.7 | C4.- 31.55,62.48 38.56,62.48 45.57,55.47 45.57,53.8 45.41,53.65 44.04,53.65 43.13,54.56 43.13,55.32 42.98,55.47 42.06,55.47 39.93,53.34 JP2.3 | IC2.2 43.13,19.81 43.13,17.07 C12.2 43.13,16.92 41.76,15.54 41.76,13.26 | 41.76,13.26 38.71,13.26 38.41,13.56 J11.GND 38.25,13.56 36.88,13.56 36.12,12.8 35.81,12.8 33.98,14.63 33.98,18.44 IC4.1 | 41.76,13.26 42.37,13.26 C16.2 | R65.1 34.44,37.03 36.58,37.03 IC5.2 36.73,37.03 36.73,37.34 39.01,39.62 41.45,39.62 46.48,34.59 46.48,33.68 44.5,31.7 43.28,31.7 42.52,30.94 C43.2 42.37,30.79 42.37,30.48 41.6,29.72 41.6,26.98 41.76,26.82 41.76,26.06 39.47,23.77 38.41,23.77 J5.GND 38.25,23.62 33.98,19.36 | 33.98,19.36 33.98,18.59 IC4.1 | Q2.E 42.52,1.68 40.23,1.68 38.41,3.5 J12.GND 38.25,3.66 38.25,5.33 34.14,9.45 31.55,9.45 C15.- 31.39,9.45 25.91,9.45 24.69,8.23 J7.GND
  Bottom 0.152: 25.15,31.39 25.3,31.24 25.3,28.8 24.69,28.19 J3.GND 24.69,28.04 26.21,26.52 26.21,23.77 J4.GND 26.36,23.62 27.13,22.86 29.57,22.86 33.07,19.36 33.98,19.36 | 25.15,31.39 24.54,32 24.54,32.31 C22.2 | 25.15,31.39 29.41,31.39 C27.2 | C34.2 22.1,11.73 24.38,11.73 26.21,13.56 J10.GND | R24.1 42.37,7.92 41,7.92 37.19,11.73 28.19,11.73 26.36,13.56 J10.GND | J9.GND 24.69,17.98 24.69,15.24 26.21,13.72 J10.GND | 33.98,19.36 IC4.1
  pour Top (isolate 0.012): 50,109 0,109 0,0 50,0
  pour Bottom (isolate 0.012): 50,109 0,109 0,0 50,0
IN_1
  Bottom 0.152: R54.1 2.44,29.57 2.44,26.06 J2.TIP
IN_2
  Bottom 0.152: R33.1 19.36,30.63 14.78,26.06 J3.TIP
IN_3
  Bottom 0.152: R36.1 34.59,29.57 34.59,27.43 35.97,26.06 J4.TIP
IN_4
  Bottom 0.152: R57.1 47.55,29.11 47.55,26.52 48.01,26.06 J5.TIP
JTCK  (via drill 0.3)
  Top 0.152: v18.14,45.72 18.14,46.94 17.83,47.24 17.83,50.6 18.59,51.36 18.59,51.66 16.31,53.95 13.11,53.95 12.5,54.56 12.5,55.78 11.12,57.15 v7.16,57.15 | v4.42,57.91 3.96,57.91 v2.74,59.13
  Bottom 0.152: v18.14,45.72 17.53,45.11 16.76,45.11 UC1.37 | v7.16,57.15 6.86,57.15 6.1,57.91 v4.42,57.91 | v2.74,59.13 1.83,59.13 0.76,58.06 0.76,54.71 1.52,53.95 JP4.4
JTDI  (via drill 0.3)
  Top 0.152: v13.72,42.82 11.73,44.81 5.49,44.81 0.76,49.53 0.76,50.44 1.52,51.21 JP4.8
  Bottom 0.152: v13.72,42.82 15.39,44.5 16.61,44.5 UC1.38
JTDO  (via drill 0.3)
  Top 0.152: v17.83,44.65 17.83,45.26 17.53,45.57 17.53,51.05 v17.98,51.51 | v19.2,55.32 19.2,61.42 v17.07,63.55 | v17.07,64.77 17.07,65.99 3.81,79.25 2.74,79.25 0.46,76.96 0.46,53.65 1.52,52.58 JP4.6
  Bottom 0.152: v17.83,44.65 17.22,44.04 16.76,44.04 UC1.39 | v17.98,51.51 17.98,51.82 19.2,53.03 v19.2,55.32 | v17.07,64.77 v17.07,63.55
JTMS  (via drill 0.3)
  Top 0.152: v12.04,49.38 10.21,49.38 v5.94,53.65
  Bottom 0.152: v12.04,49.38 14.17,47.24 14.17,46.63 UC1.34 | v5.94,53.65 3.66,55.93 2.44,55.93 1.68,55.17 JP4.2
LED_B  (via drill 0.3)
  Top 0.152: v6.4,41.6 5.64,41.6 5.18,42.06 4.57,42.06 2.44,39.93 2.44,37.95 v8.08,32.31 | v8.23,28.65 8.84,28.65 v9.75,27.74 | v10.52,30.48 v9.75,29.72 | v13.11,30.48 16.76,30.48 18.59,32.31 v18.59,33.53 | v19.96,34.9 19.96,41.6 24.38,46.02 v24.38,51.66
  Bottom 0.152: v6.4,41.6 6.86,42.06 8.23,42.06 UC1.18 | v8.08,32.31 8.38,32 8.38,28.8 v8.23,28.65 | v9.75,29.72 v9.75,27.74 | v13.11,30.48 v10.52,30.48 | v19.96,34.9 v18.59,33.53 | v24.38,51.66 24.38,52.58 R12.1
LED_CH1  (via drill 0.3)
  Top 0.152: v23.77,46.33 23.77,52.12 25.91,54.25 25.91,54.41 31.24,59.74 v31.24,79.25
  Bottom 0.152: v23.77,46.33 17.98,40.54 16.76,40.54 UC1.46 | v31.24,79.25 31.24,81.99 30.79,82.45 30.79,92.05 31.55,92.81 31.55,96.47 R6.2
LED_CH2  (via drill 0.3)
  Top 0.152: v15.7,41.6 15.7,42.67 17.22,44.2 v17.22,51.51 | v31.55,82.45 v22.4,73.3
  Bottom 0.152: v15.7,41.6 16.15,41.15 16.61,41.15 UC1.45 | v17.22,51.51 18.59,52.88 18.59,55.47 24.84,61.72 24.84,67.97 22.4,70.41 v22.4,73.3 | v31.55,82.45 31.55,85.5 R7.2
LED_CH3  (via drill 0.3)
  Top 0.152: v18.44,42.06 18.44,42.67 21.64,45.87 21.64,55.63 v21.49,55.78 | v30.63,74.52 v25.76,69.65
  Bottom 0.152: v18.44,42.06 UC1.43 | v21.49,55.78 21.49,57.91 25.76,62.18 v25.76,69.65 | v30.63,74.52 31.55,75.44 R8.2
LED_CH4  (via drill 0.3)
  Top 0.152: v25.91,49.23 25.91,50.6 28.04,52.73 v28.04,55.32 | v28.04,60.35 30.63,62.94 v30.63,69.04
  Bottom 0.152: v25.91,49.23 19.36,42.67 16.76,42.67 UC1.42 | v28.04,60.35 v28.04,55.32 | v30.63,69.04 31.55,69.95 R9.2
LED_FRAME  (via drill 0.3)
  Top 0.152: v26.21,51.66 26.21,54.25 35.2,63.25 v35.2,95.56
  Bottom 0.152: v26.21,51.66 26.21,50.29 19.05,43.13 16.76,43.13 UC1.41 | v35.2,95.56 36.12,96.47 R16.1
LED_G
  Bottom 0.152: UC1.17 8.38,41.6 11.73,41.6 16.46,46.33 21.79,46.33 25.6,50.14 25.6,51.82 26.36,52.58 26.98,52.58 R11.1
LED_R
  Bottom 0.152: UC1.19 8.38,42.67 12.34,42.67 16.46,46.79 17.53,46.79 18.14,47.4 18.14,48.77 21.95,52.58 R13.1
MODULATION
  Bottom 0.152: UC1.14 8.38,40.08 11.58,40.08 12.19,40.69 13.72,40.69 15.85,38.56 15.85,36.88 14.17,35.2 14.17,31.55 D3.3 14.02,31.39 13.72,31.09 13.72,25.45 14.33,24.84 15.39,24.84 17.53,26.98 18.14,26.98 R39.2
N$1  (via drill 0.3)
  Top 0.152: v37.49,4.72 41.6,4.72 42.82,3.5 48.16,3.5 49.53,4.88 49.53,63.7 49.07,64.16 47.24,64.16 v46.94,63.86
  Bottom 0.152: IC13.2 19.2,13.56 19.2,13.87 19.51,14.17 20.12,14.17 20.42,13.87 20.42,10.21 19.51,9.3 R64.1 21.64,7.01 23.77,7.01 26.06,4.72 v37.49,4.72 | v46.94,63.86 46.33,63.86 45.57,64.62 R15.P$3
N$2
  Bottom 0.152: R55.1 5.03,29.72 7.47,29.72 C42.1
N$3  (via drill 0.3)
  Top 0.152: v9.91,103.78 12.5,103.78 14.48,105.77 33.38,105.77 38.86,100.28 38.86,76.81 45.26,70.41 v45.26,66.45 | v48.16,35.51 v48.16,63.55 | v35.97,13.41 28.65,6.1 28.65,4.42 26.82,2.59 18.14,2.59 14.94,5.79 J7.TIP
  Bottom 0.152: v9.91,103.78 8.53,103.78 R28.2 | v48.16,63.55 v45.26,66.45 | v48.16,35.51 48.92,34.75 48.92,30.79 48.16,30.02 46.94,30.02 45.87,28.96 45.87,25.15 37.19,16.46 37.19,14.63 v35.97,13.41
N$4
  Bottom 0.152: IC9.7 16.15,98.6 14.17,98.6 13.56,99.21 R32.2 13.41,99.36 11.12,99.36 R53.1
N$5
  Bottom 0.152: R18.2 22.25,9.91 29.57,9.91 30.79,11.12 37.34,11.12 41.45,7.01 45.57,7.01 46.18,7.62 46.18,22.4 49.23,25.45 49.23,56.54 43.13,62.64 43.13,64.62 R15.P$2
N$6
  Bottom 0.152: R6.1 33.38,96.62 33.38,99.06 R2.5
N$7
  Bottom 0.152: UC1.5 13.26,37.95 13.26,34.9 12.34,33.98 Q1.X1
N$8
  Bottom 0.152: UC1.6 12.65,37.95 12.65,36.58 11.28,35.2 10.82,35.2 9.91,34.29 9.91,33.98 Q1.X2
N$9
  Bottom 0.152: IC13.1 19.66,13.41 19.66,11.12 19.51,10.97 R64.2 19.36,10.82 17.07,10.82 R41.1
N$10
  Bottom 0.152: C27.1 29.57,29.72 31.85,29.72 R35.1
N$11
  Bottom 0.152: R18.1 22.25,8.08 23.16,8.08 24.23,7.01 34.9,7.01 35.97,5.94 J6.TIP
N$12
  Bottom 0.152: 15.54,78.33 13.72,78.33 13.56,78.18 R31.1 | 15.54,78.33 16.15,78.33 IC8.6 | 15.54,78.33 15.54,77.42 19.2,73.76 20.12,73.76 21.03,72.85 21.03,66.9 20.57,66.45 IC10.4
N$13
  Bottom 0.152: R39.1 19.81,26.98 19.81,24.84 R40.2 19.81,24.69 19.81,22.55 C31.2 19.81,22.4 19.2,21.79 19.2,19.36 IC13.7
N$14  (via drill 0.3)
  Top 0.152: 17.83,17.37 v17.83,11.73 | v30.18,41 30.18,43.43 32.16,45.41 32.16,54.56 40.39,62.79 40.39,64.62 R15.P$1 | v30.79,37.49 30.79,33.07 27.89,30.18 27.89,27.13 28.65,26.36 28.65,25.3 27.43,24.08 27.43,19.36 24.99,16.92 23.93,16.92 23.47,17.37 17.83,17.37 | 17.83,17.37 v17.83,17.53
  Bottom 0.152: 16.15,9.14 16.92,9.14 R41.2 | 16.15,9.14 14.63,9.14 R42.2 | R40.1 18.14,24.69 18.14,22.55 C31.1 18.29,22.4 18.44,22.25 18.44,19.36 IC13.6 18.44,19.2 18.44,18.75 17.83,18.14 v17.83,17.53 | 16.15,9.14 16.15,11.43 16.31,11.58 17.68,11.58 v17.83,11.73 | v30.18,41 30.18,38.1 v30.79,37.49
N$15  (via drill 0.3)
  Top 0.152: v23.47,77.57 22.1,78.94 v21.03,78.94 20.27,78.18 v12.34,78.18
  Bottom 0.152: v21.03,78.94 21.95,78.94 IC8.2 | v23.47,77.57 23.93,77.57 24.38,78.03 C39.1 24.54,78.18 26.98,78.18 R49.1 | v12.34,78.18 11.12,78.18 R50.2
N$16  (via drill 0.3)
  Top 0.152: v22.1,80.47 23.32,80.47 v23.62,80.77
  Bottom 0.152: R48.1 29.41,79.86 27.13,79.86 R49.2 26.98,79.86 24.54,79.86 | v22.1,80.47 22.1,79.86 IC8.1 | 24.54,79.86 v23.62,80.77 | 24.54,79.86 C39.2
N$17  (via drill 0.3)
  Top 0.152: v14.63,105.16 v17.22,105.16
  Bottom 0.152: R28.1 8.53,105.31 10.97,105.31 R29.2 11.12,105.31 13.41,105.31 C23.2 13.56,105.31 13.72,105.16 v14.63,105.16 | v17.22,105.16 16.31,105.16 IC7.7
N$18
  Bottom 0.152: R34.1 22.1,30.63 24.38,30.63 C22.1
N$19
  Bottom 0.152: IC7.2 22.1,105 23.16,105 24.38,103.78 C38.1 24.54,103.63 26.98,103.63 R43.1 27.13,103.63 27.43,103.63 28.19,102.87 36.12,102.87 | R47.2 36.12,99.06 36.12,101.5 R46.2 36.12,101.65 36.12,102.87 | R44.2 36.12,106.38 36.12,104.09 R45.2 36.12,103.94 36.12,102.87
N$20  (via drill 0.3)
  Top 0.152: v15.54,96.62 18.14,96.62 22.4,92.35 22.86,92.35 24.99,90.22 24.99,77.88 20.27,73.15 v19.81,73.15
  Bottom 0.152: 15.54,97.84 13.72,97.84 13.56,97.69 R32.1 | 15.54,97.84 16.15,97.84 IC9.6 | v15.54,96.62 15.54,97.84 | v19.81,73.15 19.81,72.39 20.42,71.78 IC10.13
N$21  (via drill 0.3)
  Top 0.152: v14.48,104.39 v17.22,104.39 17.83,103.78 v28.04,103.78
  Bottom 0.152: v17.22,104.39 16.31,104.39 IC7.6 | v14.48,104.39 14.17,104.39 13.56,103.78 C23.1 13.41,103.63 11.12,103.63 R29.1 | v28.04,103.78 29.41,103.78 R30.2
N$22  (via drill 0.3)
  Top 0.152: v24.38,96.62 22.55,98.45 v21.03,98.45 20.27,97.69 v12.34,97.69
  Bottom 0.152: v21.03,98.45 21.95,98.45 IC9.2 | v24.38,96.62 24.38,97.54 C40.1 24.54,97.69 26.98,97.69 R52.1 | v12.34,97.69 11.12,97.69 R53.2
N$23  (via drill 0.3)
  Top 0.152: v22.1,99.97 23.77,99.97 v24.23,100.43
  Bottom 0.152: R51.1 29.41,99.36 27.13,99.36 R52.2 26.98,99.36 24.54,99.36 C40.2 24.38,99.36 24.23,99.52 v24.23,100.43 | v22.1,99.97 22.1,99.36 IC9.1
N$24
  Bottom 0.152: IC11.6 16.15,91.29 13.56,91.29 R37.1 13.41,91.14 13.41,87.78 12.19,86.56 12.19,83.52 10.21,81.53 10.21,77.42 12.95,74.68 17.22,74.68 19.2,72.69 19.2,71.78 IC10.12
N$25
  Bottom 0.152: R16.2 37.95,96.62 41.15,96.62 41.76,97.23 LED6.A
N$26  (via drill 0.3)
  Top 0.152: v24.38,90.07 22.4,92.05 v21.03,92.05 20.27,91.29 v12.34,91.29
  Bottom 0.152: v21.03,92.05 21.95,92.05 IC11.2 | v24.38,90.07 24.38,91.14 C44.1 24.54,91.14 26.98,91.14 R59.1 | v12.34,91.29 11.12,91.29 R60.2
N$27  (via drill 0.3)
  Top 0.152: v22.1,93.42 23.62,93.42 v24.08,93.88
  Bottom 0.152: R58.1 29.41,92.81 27.13,92.81 R59.2 26.98,92.81 24.54,92.81 C44.2 24.38,92.96 24.08,93.27 v24.08,93.88 | v22.1,93.42 22.1,92.81 IC11.1
N$28
  Bottom 0.152: C43.1 42.52,29.11 44.96,29.11 R56.1
N$29
  Bottom 0.152: R30.1 29.41,105.31 27.13,105.31 R43.2 26.98,105.31 24.54,105.31 C38.2 24.38,105.46 24.23,105.61 22.1,105.61 IC7.1
N$30  (via drill 0.3)
  Top 0.152: v17.22,84.89 15.24,84.89 v14.02,83.67 11.73,81.38 11.73,73.76 17.07,68.43 v17.83,68.43
  Bottom 0.152: v17.22,84.89 16.31,84.89 IC12.6 | v14.02,83.67 14.02,84.12 13.56,84.58 R38.1 | v17.83,68.43 19.2,67.06 19.2,66.45 IC10.5
N$31
  Bottom 0.152: 31.85,35.36 30.33,35.36 IC6.3 | 31.85,35.36 32.61,34.59 R27.1 | 31.85,35.36 32.61,36.12 32.61,36.88 R65.2
N$32  (via drill 0.3)
  Top 0.152: v24.38,83.67 22.55,85.5 v21.03,85.5 18.59,87.94 v12.8,87.94
  Bottom 0.152: v21.03,85.5 21.95,85.5 IC12.2 | v24.38,83.67 24.38,84.58 C46.1 24.54,84.73 26.98,84.73 R62.1 | v12.8,87.94 11.89,87.02 11.89,85.8 11.12,85.04 11.12,84.73 R63.2
N$33  (via drill 0.3)
  Top 0.152: v22.1,86.87 23.62,86.87 v24.08,87.33
  Bottom 0.152: R61.1 29.41,86.41 27.13,86.41 R62.2 26.98,86.41 24.54,86.41 C46.2 24.38,86.41 24.08,86.72 v24.08,87.33 | v22.1,86.87 22.1,86.26 IC12.1
N$34
  Top 0.152: J1.NORM 10.82,5.94 13.41,5.94 18.29,10.82 20.27,10.82 28.35,18.9 28.35,23.47 29.26,24.38 29.26,26.36 28.19,27.43 28.19,30.02 30.63,32.46 33.38,32.46 43.74,42.82 45.87,42.82 S1.2
N$35
  Bottom 0.152: R13.2 22.1,54.41 22.1,56.08 22.55,56.54 LED5.RED
N$36
  Bottom 0.152: R12.2 24.54,54.41 24.54,55.93 25.15,56.54 LED5.BLU
N$37
  Bottom 0.152: R11.2 26.98,54.41 26.98,56.08 26.52,56.54 LED5.GRN
N$38
  Bottom 0.152: R7.1 33.38,85.65 33.38,88.54 R3.5
N$39  (via drill 0.3)
  Top 0.152: v13.26,54.56 13.26,56.69 v12.34,57.61 | v7.77,58.83 v11.89,58.83
  Bottom 0.152: v13.26,54.56 13.11,54.41 11.43,54.41 11.28,54.56 11.28,55.17 IC3.2 | v12.34,57.61 12.34,58.37 v11.89,58.83 | v7.77,58.83 7.77,59.59 7.47,59.89 R19.1
N$40  (via drill 0.3)
  Top 0.152: v35.81,73.91 35.81,60.05 31.55,55.78 v31.55,47.4 | v32.77,44.81 32.77,42.37 22.1,31.7 22.1,25.45 21.18,24.54 13.72,24.54 7.62,30.63 6.1,30.63 4.12,32.61 3.81,32.61 3.35,32.16 3.35,26.36 3.5,26.21 3.5,17.07 2.44,16 J8.TIP
  Bottom 0.152: v35.81,73.91 35.51,74.22 33.22,74.22 32.61,74.83 32.61,76.05 32.31,76.35 31.09,76.35 30.63,75.89 26.98,75.89 26.52,76.35 26.52,76.66 26.98,77.11 27.43,77.11 28.35,78.03 29.41,78.03 R48.2 | v31.55,47.4 32.77,46.18 v32.77,44.81
N$41
  Bottom 0.152: IC3.3 11.58,55.32 11.58,58.37 11.28,58.67 11.28,59.89 R20.1
N$42
  Top 0.152: S1.3 45.87,40.23 45.87,34.75 45.26,34.14 JP1.2
N$43
  Bottom 0.152: IC3.4 12.19,55.32 12.19,56.69 15.39,59.89 R21.1
N$44
  Bottom 0.152: 43.59,6.25 44.96,6.25 R25.1 45.11,6.1 47.85,6.1 48.01,5.94 J12.TIP | 43.59,6.25 42.52,6.25 R24.2 | 43.59,6.25 43.59,3.96 Q2.C
N$45
  Bottom 0.152: IC3.5 12.65,55.17 13.72,55.17 13.87,55.02 15.09,55.02 19.2,59.13 19.2,59.89 R22.1
N$46
  Bottom 0.152: R8.1 33.38,75.59 33.38,77.88 R4.5
N$47
  Bottom 0.152: R23.2 46.94,1.68 44.5,1.68 Q2.B
N$48  (via drill 0.3)
  Top 0.152: v17.22,85.65 15.7,85.65 v14.02,87.33 v11.43,87.33
  Bottom 0.152: v17.22,85.65 16.31,85.65 IC12.7 | v14.02,87.33 14.02,86.87 13.56,86.41 R38.2 | v11.43,87.33 11.12,87.02 11.12,86.41 R63.1
N$49  (via drill 0.3)
  Top 0.152: v32.77,97.69 34.44,97.69 37.49,100.74 37.8,100.74 38.56,99.97 38.56,74.68 41.91,71.32 41.91,63.4 35.36,56.84 35.36,48.16 30.79,43.59 30.79,40.84 19.96,30.02 v19.96,29.26 | v17.22,19.96 17.22,18.9 v17.07,18.75
  Bottom 0.152: v32.77,97.69 29.57,97.69 R51.2 | v19.96,29.26 19.96,28.5 18.9,27.43 18.9,26.36 18.14,25.6 17.53,25.6 17.22,25.3 v17.22,19.96 | v17.07,18.75 17.07,17.83 15.24,16 14.94,16 J9.TIP
N$50  (via drill 0.3)
  Top 0.152: v44.81,61.72 44.81,46.63 39.17,41 v39.17,39.01 | v41.15,26.67 41.15,24.23 48.01,17.37 48.01,16 J11.TIP
  Bottom 0.152: v44.81,61.72 44.5,62.03 44.5,69.04 33.98,79.55 32.61,79.55 31.7,78.64 31.09,78.64 30.63,79.1 30.63,80.16 29.57,81.23 29.57,84.58 R61.2 | v39.17,39.01 39.47,39.01 43.89,34.59 43.89,33.53 42.06,31.7 41.91,31.7 41.15,30.94 v41.15,26.67
N$51  (via drill 0.3)
  Top 0.152: v46.79,17.83 37.95,17.83 36.12,16 J10.TIP
  Bottom 0.152: v46.79,17.83 49.53,20.57 49.53,64.62 39.47,74.68 39.47,89.15 33.83,94.79 33.68,94.79 32.61,95.86 32.61,96.93 32.16,97.38 31.09,97.38 30.79,97.08 30.79,92.51 29.57,91.29 R58.2
N$52
  Bottom 0.152: R9.1 33.38,69.95 33.38,67.51 R5.5
N$53
  Bottom 0.406: B1.~1 42.5,53.25 L1.2
N$54
  Bottom 0.406: L2.2 42.95,46.7 B1.~2
N$56
  Bottom 0.406: L1.1 40.47,56.4 JP2.1 JP2.2
N$64
  Bottom 0.406: L2.1 40.33,45.1 JP2.9 JP2.10
PAN
  Top 0.152: J4.NORM 23.47,25.91 J3.NORM 23.32,25.91 23.01,25.91 21.34,24.23 11.73,24.23 10.67,25.3 | 10.67,25.3 9.75,24.38 9.75,15.54 2.44,8.23 2.44,5.94 J1.TIP | 10.67,25.3 10.67,25.91 J2.NORM 10.67,25.3
  Bottom 0.152: J5.NORM 39.62,25.91 37.64,25.91 35.2,23.47 28.96,23.47 27.74,24.69 27.74,25.91 J4.NORM
POT_CH1  (via drill 0.3)
  Top 0.152: v11.43,39.17 14.02,39.17 18.75,43.89 18.75,46.79 18.14,47.4 18.14,50.44 18.9,51.21 18.9,52.12 v17.98,53.03 | v17.98,54.56 17.98,61.87 v16.31,63.55 | v5.18,75.89 v16.31,64.77
  Bottom 0.152: v11.43,39.17 11.28,39.17 10.82,38.71 10.82,38.1 UC1.10 | v17.98,54.56 v17.98,53.03 | v16.31,64.77 v16.31,63.55 | v5.18,75.89 5.18,104.7 3.35,106.53 R2.1
POT_CH2  (via drill 0.3)
  Top 0.152: v12.04,39.78 12.65,39.78 12.95,39.47 13.26,39.47 15.09,41.3 15.09,42.52 16.46,43.89 16.46,47.09 9.6,53.95 8.53,53.95 5.03,57.45 5.03,63.09 v1.68,66.45
  Bottom 0.152: v12.04,39.78 11.28,39.78 10.36,38.86 10.36,38.1 UC1.11 | v1.68,66.45 1.68,75.44 0.46,76.66 0.46,93.27 3.2,96.01 R3.1
POT_CH3  (via drill 0.3)
  Top 0.152: v10.21,39.47 10.52,39.47 13.26,42.22 13.87,42.22 14.33,42.67 14.33,42.98 12.19,45.11 5.64,45.11 5.18,45.57 5.18,47.24 6.4,48.46 6.4,51.66 4.12,53.95 4.12,57 1.07,60.05 v1.07,76.81
  Bottom 0.152: v10.21,39.47 9.75,39.01 9.75,38.1 UC1.12 | v1.07,76.81 1.07,83.21 3.2,85.34 R4.1
POT_CH4  (via drill 0.3)
  Top 0.152: v9.3,39.47 5.49,43.28 3.5,43.28 v3.05,43.74 | v5.79,45.72 9.14,45.72 12.65,49.23 12.65,49.53 12.19,49.99 10.52,49.99 v6.71,53.8 | v5.94,57.3 5.94,62.94 1.98,66.9 1.98,73.61 3.2,74.83 R5.1
  Bottom 0.152: v9.3,39.47 8.38,39.47 UC1.13 | v3.05,43.74 5.03,45.72 v5.79,45.72 | v6.71,53.8 6.71,56.54 v5.94,57.3
POT_FRAME  (via drill 0.3)
  Top 0.152: v3.05,39.78 3.05,39.47 v10.52,32 | v12.34,32.31 16.46,32.31 v17.37,33.22
  Bottom 0.152: v3.05,39.78 3.2,39.62 6.55,39.62 7.47,40.54 8.23,40.54 UC1.15 | v10.52,32 12.04,32 v12.34,32.31 | v17.37,33.22 17.37,33.83 24.38,40.84 R14.P$2
RESET  (via drill 0.3)
  Top 0.152: v13.11,40.08 14.02,41 v14.02,41.15 | v9.3,41 8.23,41 5.33,43.89 4.12,43.89 v1.52,46.48
  Bottom 0.152: v13.11,40.08 12.34,39.32 12.34,38.1 UC1.7 | v14.02,41.15 9.45,41.15 v9.3,41 | v1.52,46.48 1.52,47.4 R1.1 1.68,47.55 1.68,49.99 JP4.10
VCA0_1
  Bottom 0.152: IC8.7 16.15,79.1 14.17,79.1 13.56,79.7 R31.2 13.41,79.86 11.12,79.86 R50.1
VCA0_3
  Bottom 0.152: IC11.7 16.15,92.2 14.17,92.2 13.56,92.81 R37.2 13.41,92.81 11.12,92.81 R60.1
VCA_1  (via drill 0.3)
  Top 0.152: v37.03,92.35 37.03,72.54 36.88,72.39 36.88,66.45 v39.32,64.01 | v43.43,59.89 43.43,45.72 33.22,35.51 v33.22,33.07 | v28.65,24.54 28.65,24.23 27.74,23.32 27.74,18.75 20.12,11.12 16.76,11.12 12.65,7.01 11.73,7.01 10.82,7.92 10.82,15.85 J8.NORM
  Bottom 0.152: v37.03,92.35 37.03,104.7 37.8,105.46 37.8,106.38 R44.1 | v43.43,59.89 v39.32,64.01 | v33.22,33.07 33.22,28.96 30.48,26.21 29.72,26.21 28.65,25.15 v28.65,24.54
VCA_2  (via drill 0.3)
  Top 0.152: v39.47,97.38 39.47,76.66 46.94,69.19 v46.94,65.53 | v48.92,63.55 48.92,33.53 47.09,31.7 30.79,31.7 30.33,31.24 30.33,29.41 32.46,27.28 32.46,23.93 28.96,20.42 28.96,15.7 28.04,14.78 24.99,14.78 v24.69,14.48
  Bottom 0.152: v39.47,97.38 37.95,98.91 R47.1 | v48.92,63.55 v46.94,65.53 | v24.69,14.48 23.32,15.85 J9.NORM
VCA_3  (via drill 0.3)
  Top 0.152: v37.64,100.13 37.64,75.13 41.6,71.17 41.6,63.55 34.75,56.69 v34.75,48.31 | v34.75,44.81 34.75,42.67 27.28,35.2 v27.28,30.79 | v28.8,27.89 28.8,27.28 29.57,26.52 29.57,21.49 28.65,20.57 28.65,16.92 27.74,16 J10.NORM
  Bottom 0.152: v37.64,100.13 37.8,100.28 37.8,101.5 R46.1 | v34.75,44.81 v34.75,48.31 | v27.28,30.79 27.28,29.41 v28.8,27.89
VCA_4  (via drill 0.3)
  Top 0.152: v42.06,72.85 42.06,71.63 44.04,69.65 44.04,64.31 36.12,56.39 36.12,55.17 36.88,54.41 40.39,54.41 41.15,53.65 41.15,47.7 40.23,46.79 39.32,46.79 38.56,46.02 38.56,45.11 31.55,38.1 30.63,38.1 27.89,35.36 27.89,30.63 25.76,28.5 25.76,26.82 v25.45,26.52 | v29.87,20.57 35.66,14.78 37.34,14.78 38.41,15.85 39.62,15.85 J11.NORM
  Bottom 0.152: v42.06,72.85 42.06,82.3 42.82,83.06 42.82,99.97 38.86,103.94 37.95,103.94 R45.1 | v25.45,26.52 25.45,24.38 25.15,24.08 25.15,23.32 27.89,20.57 v29.87,20.57
VCC
  Bottom 0.406: R25.2 44.96,7.92 44.15,7.92 39.83,12.24 35.61,12.24 29.41,18.44 IC4.3 29.26,18.59 26.01,18.59 24.33,20.27 20.73,20.27 | 4.27,14.66 4.27,11.43 3.96,11.12 C11.+ | 4.27,14.66 4.27,18.44 IC1.3 | 19.81,15.54 19.81,19.2 IC13.8 19.81,19.36 20.73,20.27 | 19.81,15.54 21.95,13.41 C34.1 | 20.73,20.27 20.73,35.31 22.1,36.68 22.1,36.73 R26.1 22.25,36.73 24.54,36.73 IC6.8 25.46,36.72 28.55,39.8 28.55,45.5 27,47.05 27,49.5 28.55,51.05 28.55,52.4 31.39,55.24 31.39,58.37 C4.+ | 4.27,14.66 18.92,14.66 19.81,15.54 | B1.+ 44.65,54.56 44.65,55.73 42.01,58.37 31.55,58.37 C4.+ | C29.1 16.31,107.44 16.31,105.77 IC7.8 16.18,105.72 16.15,105.74 15.6,105.74 15.42,105.56 15.42,102.54 16.31,101.65 C30.1 16.31,101.5 16.31,99.36 IC9.8 16.31,99.21 16.74,99.21 17.07,98.88 17.07,95.71 16.46,95.1 C35.1 16.31,94.94 16.31,92.81 IC11.8 16.31,92.66 16.87,92.66 17.07,92.46 17.07,89.15 16.46,88.54 C24.1 16.31,88.39 16.31,86.26 IC12.8 16.24,86.23 15.7,86.23 15.42,85.95 15.42,83.97 16.31,83.08 16.31,82.14 C26.1 16.31,81.99 16.31,80.39 | 24.54,71.93 24.38,71.78 IC10.16 24.54,71.93 | 24.54,71.93 24.66,72.06 | 24.66,72.06 24.84,72.24 26.36,72.24 C25.1 26.53,72.35 27.41,71.48 27.41,63.93 31.39,59.94 31.39,58.52 C4.+ | 16.31,80.39 16.31,79.86 IC8.8 | 24.66,72.06 22.43,74.3 21.49,74.3 17.07,78.72 17.07,79.63 16.31,80.39
VEE  (via drill 0.3)
  Top 0.406: v16,73.5 18.12,75.62 v21.12,75.62
  Bottom 0.406: 13,69.88 10.25,69.88 U$1.A 9.38,68.98 9.38,66.88 8.5,66 8.5,58.88 9.63,57.75 9.63,50.63 8.5,49.5 5.5,49.5 5,49 5,46.78 4.32,46.1 2.6,46.1 2,45.5 2,39.5 2.5,39 7.38,39 8.99,37.38 8.99,20.5 | 13,69.88 13,71.62 15.38,71.62 IC10.9 15.5,71.75 16,72.25 v16,73.5 | 13,69.88 C36.2 | IC13.4 17.75,13.38 14.5,13.38 R42.1 13.35,10.85 12.5,10 2.38,10 1.87,10.5 1.87,12.13 3.5,13.76 3.5,16.5 2.87,17.14 2.87,19.5 3.87,20.5 8.99,20.5 | 8.99,20.5 13.25,20.5 15.5,18.25 C48.2 | 22.12,75.62 22.12,75.5 C37.2 | 22.12,75.62 22.12,77.75 IC8.4 22.12,77.88 22.88,77.88 22.88,81.37 22.25,82 C28.2 22.12,82 22.12,84.25 IC12.4 22.12,84.38 22.88,84.38 22.88,87.87 22.25,88.5 C41.2 22.12,88.5 22.12,90.75 IC11.4 22.12,90.88 22.88,90.88 22.88,94.37 22.25,95 C47.2 22.12,95 22.12,96.75 | IC7.4 22.12,103.75 22.12,101.5 C45.2 22.25,101.5 22.88,100.87 22.88,97.5 22.12,96.75 | 22.12,96.75 22.12,97.25 IC9.4 | 30.63,44.13 31.5,45 C21.- | 30.63,44.13 29.5,43 29.5,34.88 30.25,34.88 IC6.4 | 30.63,44.13 47.26,44.13 48.5,45.38 48.5,53.37 47.38,54.5 B1.- 47.25,54.62 47.25,55 36.75,65.5 36.75,72 35,73.75 24,73.75 22.25,75.5 C37.2 | 22.12,75.62 v21.12,75.62 | 22.12,75.62 C37.2

## Text on the board
bPlace: Original design by Olivier Gillet | 2019 - V3.2 | Mod by Codex Modulex | CC-BY-SA-3.0
bNames: µSlices | EITHER WAY